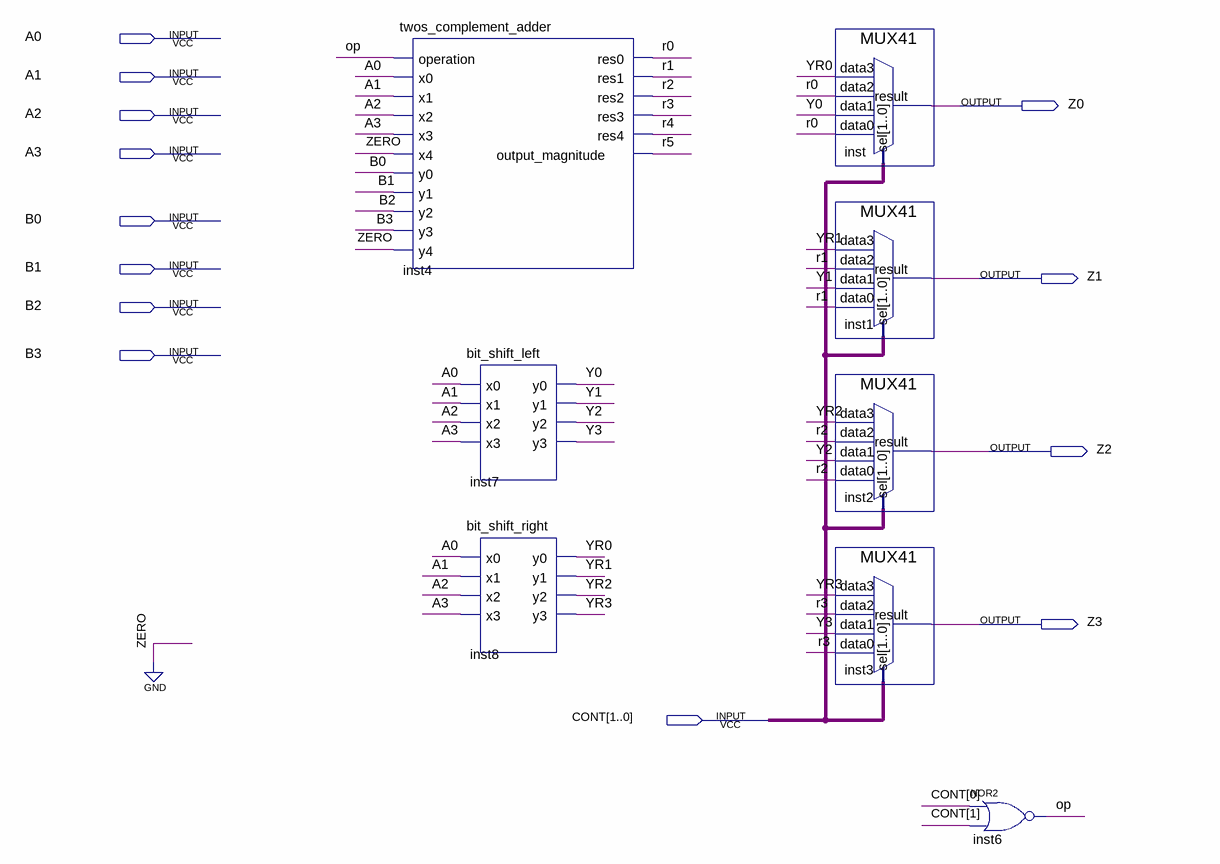
[diagram p0: schematic sheet]
// Quartus schematic ULA.bdf as structural Verilog: 8 symbols, 13 pins
module ULA (
  input  A0,
  input  A1,
  input  A2,
  input  A3,
  input  B0,
  input  B1,
  input  B2,
  input  B3,
  input  [1:0] CONT,
  output Z0,
  output Z1,
  output Z2,
  output Z3
);

  wire op, r0, r1, r2, r3, r4, r5, Y0, Y1, Y2, Y3, YR0, YR1, YR2, YR3;

  twos_complement_adder inst4 (
    .operation(op), .x0(A0), .x1(A1), .x2(A2), .x3(A3), .x4(1'b0), .y0(B0), .y1(B1), .y2(B2), .y3(B3),
    .y4(1'b0), .res0(r0), .res1(r1), .res2(r2), .res3(r3), .res4(r4), .output_magnitude(r5));
  bit_shift_left inst7 (.x0(A0), .x1(A1), .x2(A2), .x3(A3), .y0(Y0), .y1(Y1), .y2(Y2), .y3(Y3));
  bit_shift_right inst8 (.x0(A0), .x1(A1), .x2(A2), .x3(A3), .y0(YR0), .y1(YR1), .y2(YR2), .y3(YR3));
  MUX41 inst (.data3(YR0), .data2(r0), .data1(Y0), .data0(r0), .sel(CONT), .result(Z0));
  MUX41 inst1 (.data3(YR1), .data2(r1), .data1(Y1), .data0(r1), .sel(CONT), .result(Z1));
  MUX41 inst2 (.data3(YR2), .data2(r2), .data1(Y2), .data0(r2), .sel(CONT), .result(Z2));
  MUX41 inst3 (.data3(YR3), .data2(r3), .data1(Y3), .data0(r3), .sel(CONT), .result(Z3));
  nor inst6 (op, CONT[0], CONT[1]);
endmodule
